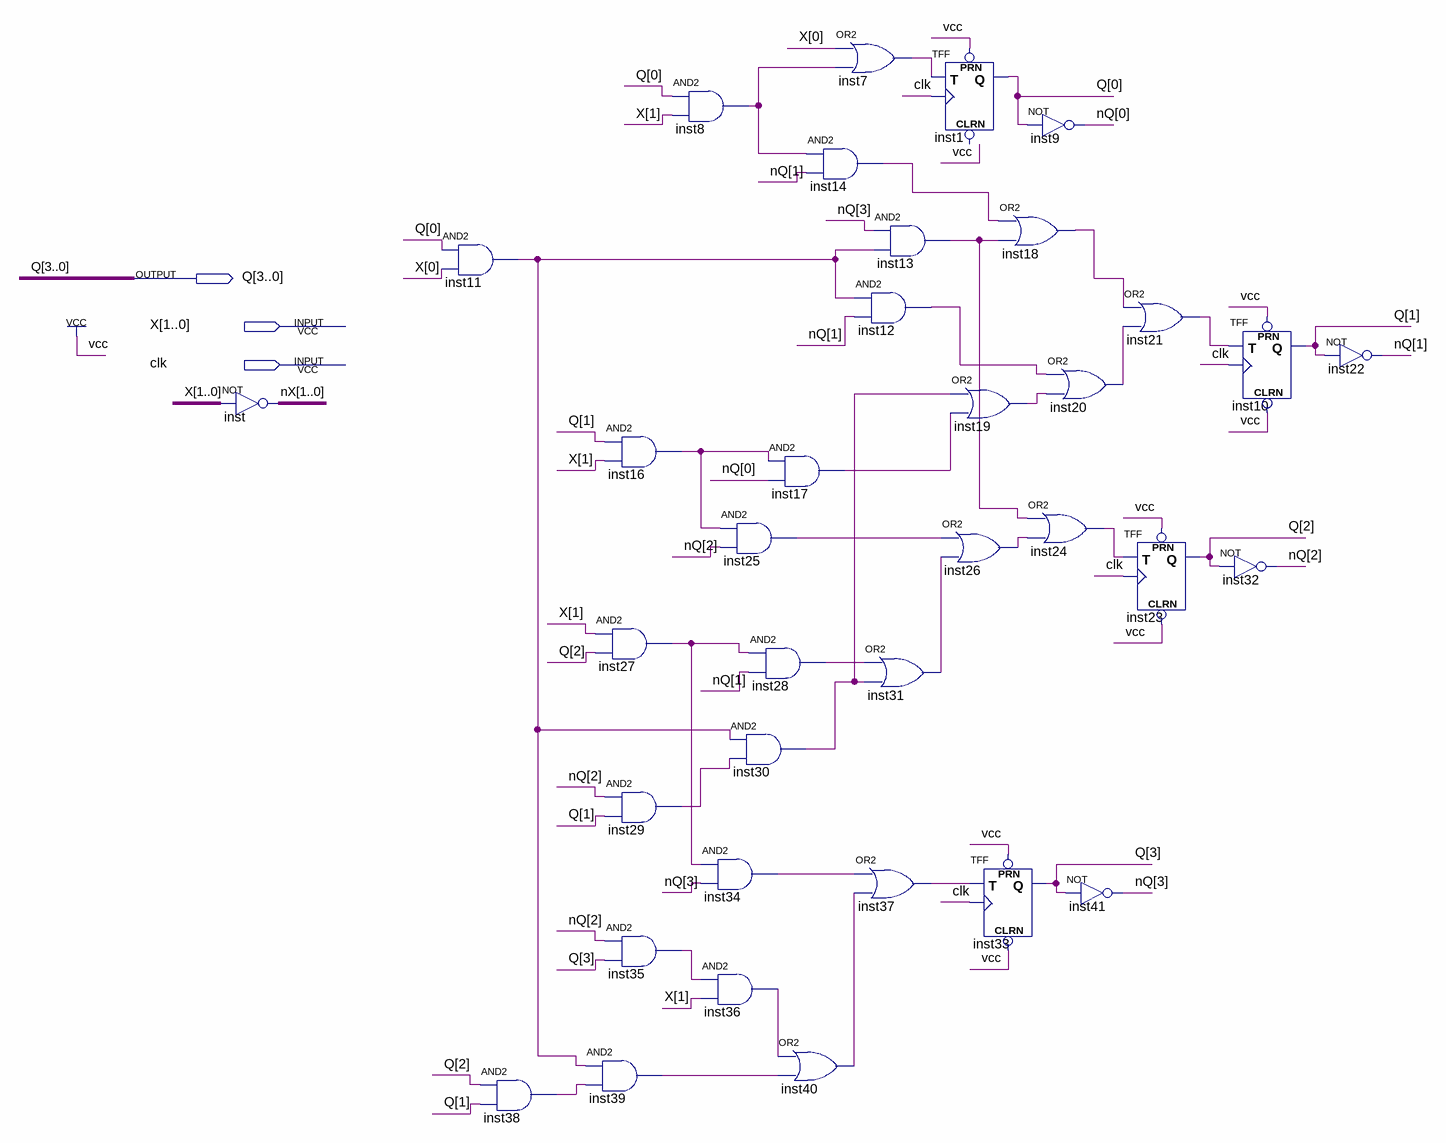
[diagram p0: schematic sheet]
// Quartus schematic TT.bdf as structural Verilog: 36 symbols, 3 pins
module TT (
  input  [1:0] X,
  input  clk,
  output [3:0] Q
);

  wire inst7_out, inst8_out, inst11_out, inst12_out, inst13_out, inst14_out, inst16_out, inst17_out,
       inst18_out, inst19_out, inst20_out, inst21_out, inst24_out, inst25_out, inst26_out, inst27_out,
       inst28_out, inst29_out, inst30_out, inst31_out, inst34_out, inst35_out, inst36_out, inst37_out,
       inst38_out, inst39_out, inst40_out;
  wire [1:0] nX;
  wire [3:0] nQ;

  assign nX = ~X;  // NOT inst, 2 bits wide
  and inst11 (inst11_out, Q[0], X[0]);
  and inst38 (inst38_out, Q[2], Q[1]);
  and inst16 (inst16_out, Q[1], X[1]);
  and inst27 (inst27_out, X[1], Q[2]);
  and inst29 (inst29_out, nQ[2], Q[1]);
  and inst35 (inst35_out, nQ[2], Q[3]);
  and inst39 (inst39_out, inst11_out, inst38_out);
  and inst8 (inst8_out, Q[0], X[1]);
  and inst17 (inst17_out, inst16_out, nQ[0]);
  and inst25 (inst25_out, inst16_out, nQ[2]);
  and inst28 (inst28_out, inst27_out, nQ[1]);
  and inst30 (inst30_out, inst11_out, inst29_out);
  and inst34 (inst34_out, inst27_out, nQ[3]);
  and inst36 (inst36_out, inst35_out, X[1]);
  or inst7 (inst7_out, X[0], inst8_out);
  and inst14 (inst14_out, inst8_out, nQ[1]);
  or inst40 (inst40_out, inst36_out, inst39_out);
  and inst13 (inst13_out, nQ[3], inst11_out);
  and inst12 (inst12_out, inst11_out, nQ[1]);
  or inst31 (inst31_out, inst28_out, inst30_out);
  or inst37 (inst37_out, inst34_out, inst40_out);
  TFF inst1 (.PRN(1'b1), .T(inst7_out), .CLK(clk), .Q(Q[0]));  // open: CLRN
  or inst18 (inst18_out, inst14_out, inst13_out);
  or inst19 (inst19_out, inst30_out, inst17_out);
  or inst26 (inst26_out, inst25_out, inst31_out);
  TFF inst33 (.PRN(1'b1), .CLRN(1'b1), .T(inst37_out), .CLK(clk), .Q(Q[3]));
  not inst9 (nQ[0], Q[0]);
  or inst20 (inst20_out, inst12_out, inst19_out);
  or inst24 (inst24_out, inst13_out, inst26_out);
  not inst41 (nQ[3], Q[3]);
  or inst21 (inst21_out, inst18_out, inst20_out);
  TFF inst23 (.PRN(1'b1), .CLRN(1'b1), .T(inst24_out), .CLK(clk), .Q(Q[2]));
  TFF inst10 (.PRN(1'b1), .CLRN(1'b1), .T(inst21_out), .CLK(clk), .Q(Q[1]));
  not inst32 (nQ[2], Q[2]);
  not inst22 (nQ[1], Q[1]);
endmodule
